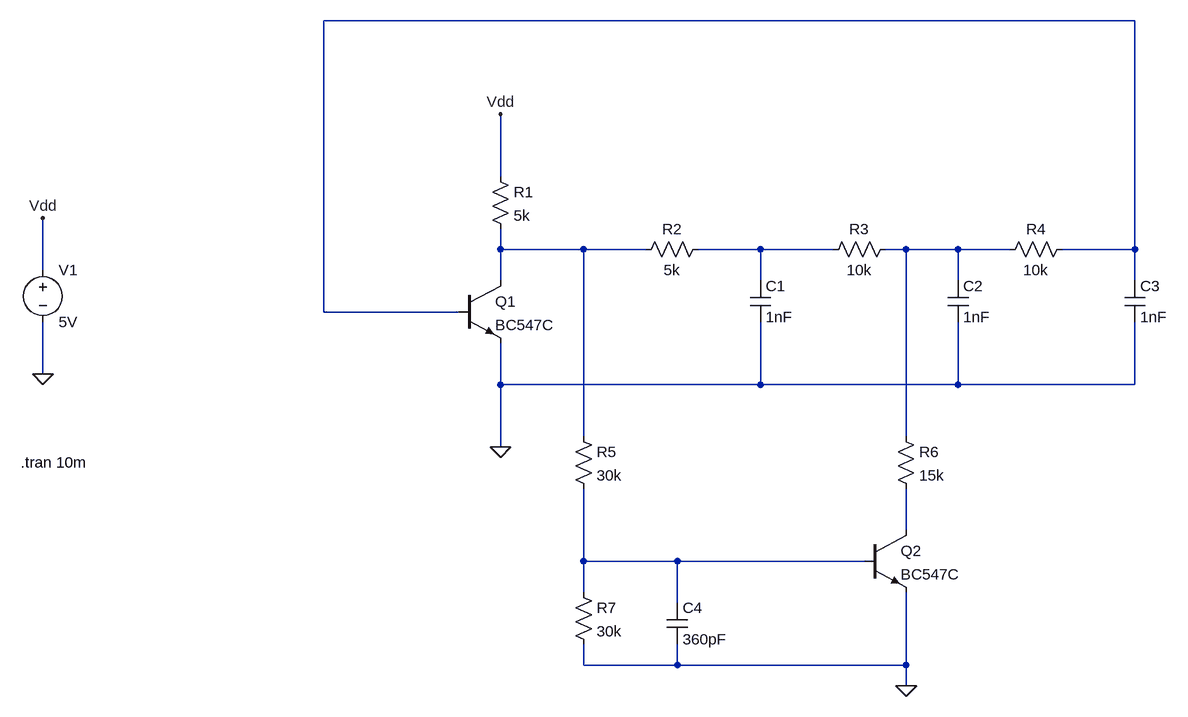
[diagram p0: schematic chaotic_osc.asc]
chaotic_osc.asc, the LTspice schematic file:
Version 4
SHEET 1 1144 836
WIRE 1088 -208 -160 -208
WIRE 112 32 112 -64
WIRE 112 144 112 112
WIRE 240 144 112 144
WIRE 336 144 240 144
WIRE 512 144 416 144
WIRE 624 144 512 144
WIRE 736 144 704 144
WIRE 816 144 736 144
WIRE 896 144 816 144
WIRE 1088 144 1088 -208
WIRE 1088 144 976 144
WIRE -592 176 -592 96
WIRE 112 192 112 144
WIRE 512 192 512 144
WIRE 816 192 816 144
WIRE 1088 192 1088 144
WIRE -160 240 -160 -208
WIRE 48 240 -160 240
WIRE -592 336 -592 256
WIRE 112 352 112 288
WIRE 512 352 512 256
WIRE 512 352 112 352
WIRE 816 352 816 256
WIRE 816 352 512 352
WIRE 1088 352 1088 256
WIRE 1088 352 816 352
WIRE 240 432 240 144
WIRE 736 432 736 144
WIRE 112 448 112 352
WIRE 736 576 736 512
WIRE 240 624 240 512
WIRE 384 624 240 624
WIRE 672 624 384 624
WIRE 240 672 240 624
WIRE 384 688 384 624
WIRE 240 784 240 752
WIRE 384 784 384 752
WIRE 384 784 240 784
WIRE 736 784 736 672
WIRE 736 784 384 784
WIRE 736 816 736 784
FLAG 112 448 0
FLAG 112 -64 Vdd
FLAG -592 336 0
FLAG -592 96 Vdd
FLAG 736 816 0
SYMBOL res 96 16 R0
SYMATTR InstName R1
SYMATTR Value 5k
SYMBOL res 432 128 R90
WINDOW 0 0 56 VBottom 2
WINDOW 3 32 56 VTop 2
SYMATTR InstName R2
SYMATTR Value 5k
SYMBOL res 720 128 R90
WINDOW 0 0 56 VBottom 2
WINDOW 3 32 56 VTop 2
SYMATTR InstName R3
SYMATTR Value 10k
SYMBOL res 992 128 R90
WINDOW 0 0 56 VBottom 2
WINDOW 3 32 56 VTop 2
SYMATTR InstName R4
SYMATTR Value 10k
SYMBOL cap 496 192 R0
SYMATTR InstName C1
SYMATTR Value 1nF
SYMBOL cap 800 192 R0
SYMATTR InstName C2
SYMATTR Value 1nF
SYMBOL cap 1072 192 R0
SYMATTR InstName C3
SYMATTR Value 1nF
SYMBOL npn 48 192 R0
SYMATTR InstName Q1
SYMATTR Value BC547C
SYMBOL voltage -592 160 R0
WINDOW 123 0 0 Left 0
WINDOW 39 0 0 Left 0
SYMATTR InstName V1
SYMATTR Value 5V
SYMBOL res 224 416 R0
SYMATTR InstName R5
SYMATTR Value 30k
SYMBOL res 720 416 R0
SYMATTR InstName R6
SYMATTR Value 15k
SYMBOL res 224 656 R0
SYMATTR InstName R7
SYMATTR Value 30k
SYMBOL cap 368 688 R0
SYMATTR InstName C4
SYMATTR Value 360pF
SYMBOL npn 672 576 R0
SYMATTR InstName Q2
SYMATTR Value BC547C
TEXT -626 472 Left 2 !.tran 10m

The netlist it stands for:
* chaotic_osc.asc
R1 Vdd N002 5k
R2 N003 N002 5k
R3 N004 N003 10k
R4 N001 N004 10k
C1 N003 0 1nF
C2 N004 0 1nF
C3 N001 0 1nF
Q1 N002 N001 0 0 BC547C
V1 Vdd 0 5V
R5 N002 N006 30k
R6 N004 N005 15k
R7 N006 0 30k
C4 N006 0 360pF
Q2 N005 N006 0 0 BC547C
.model NPN NPN
.model PNP PNP
.lib standard.bjt
.tran 10m
.backanno
.end